# EAGLE design gases2 (EAGLE 9.6.2)
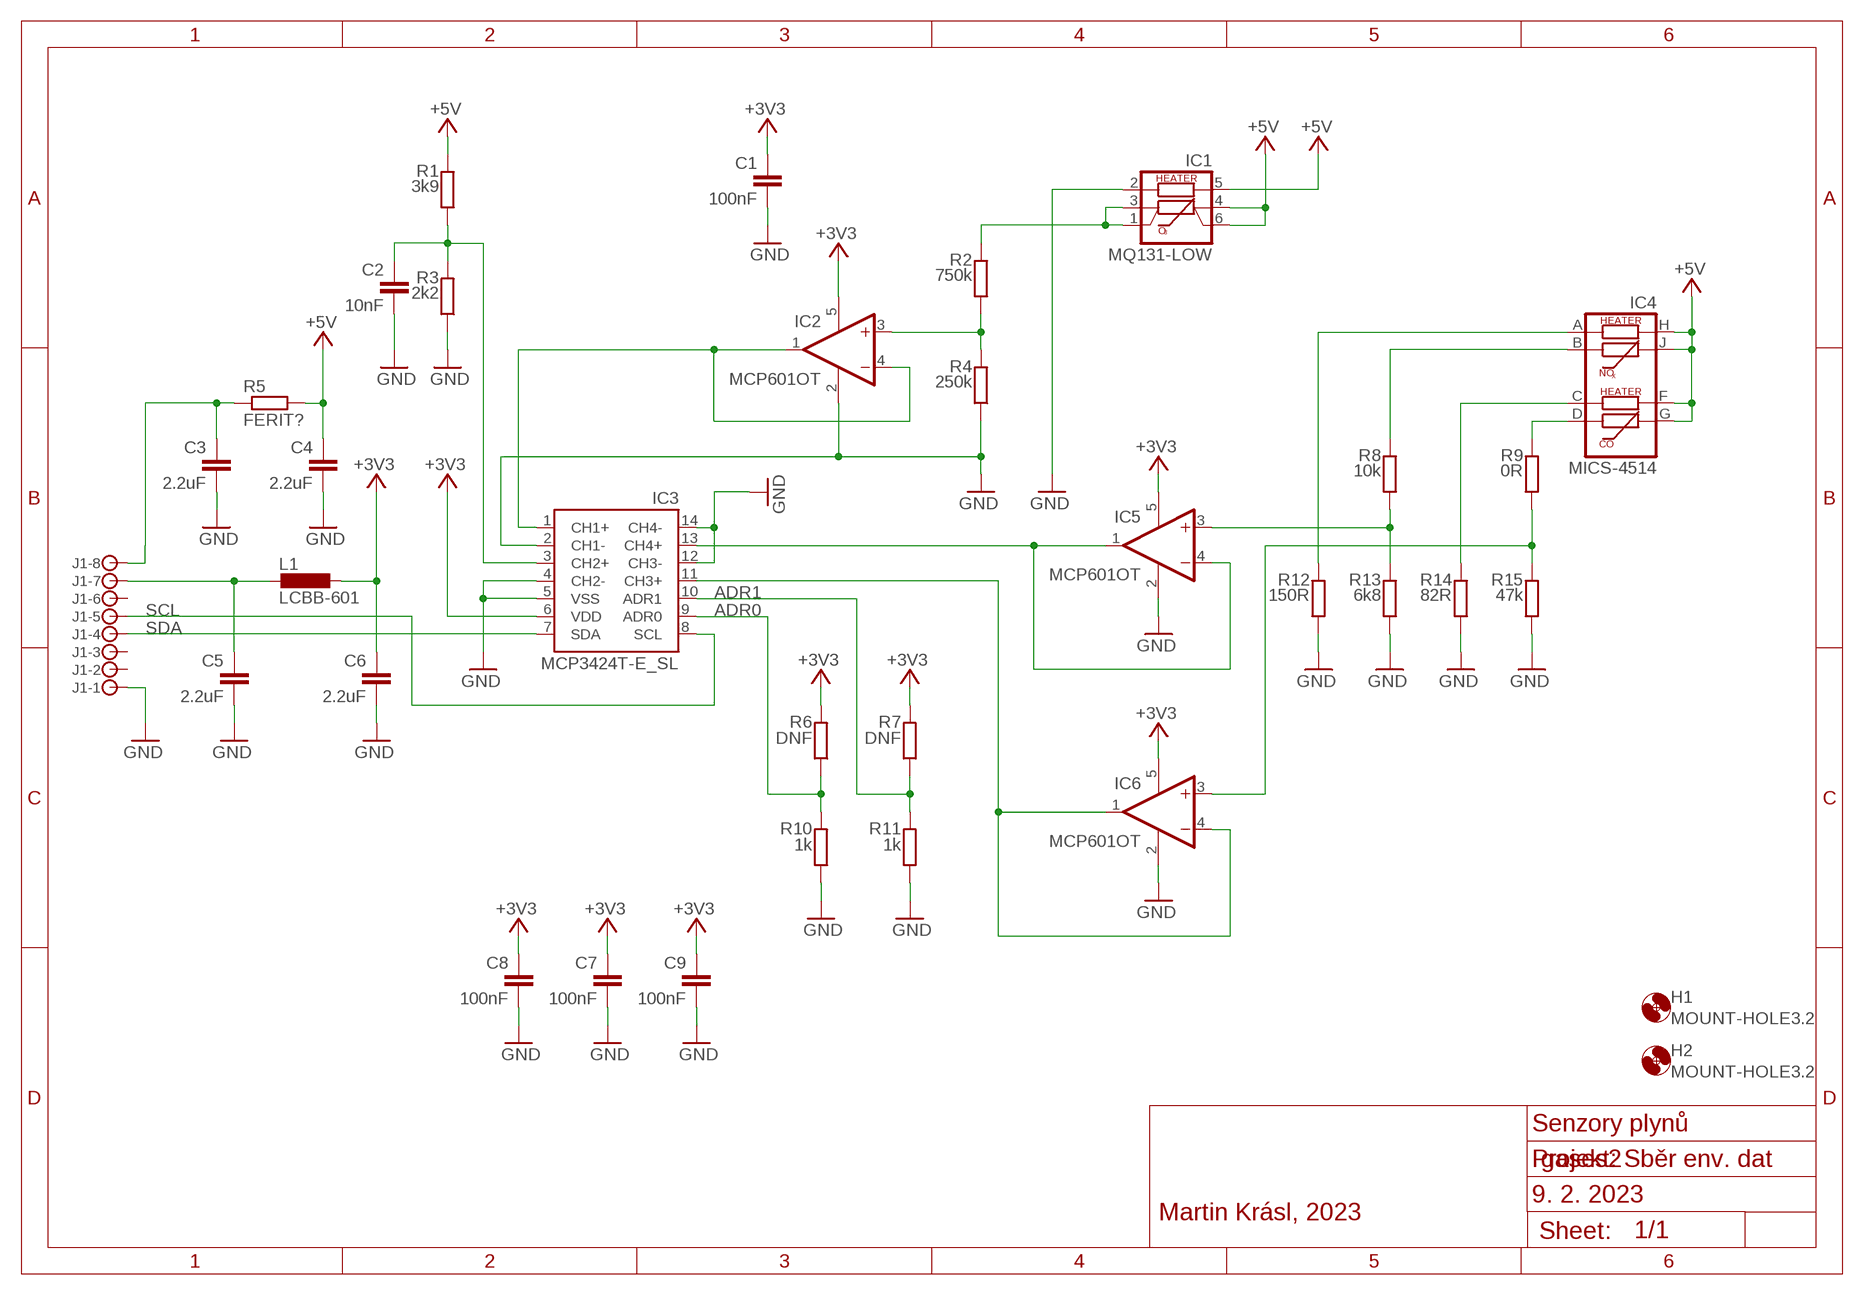
[diagram p0: schematic, sheet 1]

## Parts
C1  100nF  C-EUC0402  [C0402]
C2  10nF  C-EUC0402  [C0402]
C3  2.2uF  C-EUC0402  [C0402]
C4  2.2uF  C-EUC0402  [C0402]
C5  2.2uF  C-EUC0402  [C0402]
C6  2.2uF  C-EUC0402  [C0402]
C7  100nF  C-EUC0402  [C0402]
C8  100nF  C-EUC0402  [C0402]
C9  100nF  C-EUC0402  [C0402]
H1  MOUNT-HOLE3.2  [3,2]
H2  MOUNT-HOLE3.2  [3,2]
IC1  MQ131-LOW  [MQ131-LOW]
IC2  MCP601OT  [SOT23-5]
IC3  MCP3424T-E_SL  [SOIC127P600X175-14N]
IC4  MICS-4514  [MICS-4514]
IC5  MCP601OT  [SOT23-5]
IC6  MCP601OT  [SOT23-5]
J1  JST-XH-8  [B8B-XH-A]
L1  LCBB-601  L-EU2012(0805)  [L2012C]
R1  3k9  R-EU_R0402  [R0402]
R2  750k  R-EU_R0402  [R0402]
R3  2k2  R-EU_R0402  [R0402]
R4  250k  R-EU_R0402  [R0402]
R5  FERIT?  R-EU_R0805  [R0805]
R6  DNF  R-EU_R0402  [R0402]
R7  DNF  R-EU_R0402  [R0402]
R8  10k  R-EU_R0402  [R0402]
R9  0R  R-EU_R0402  [R0402]
R10  1k  R-EU_R0402  [R0402]
R11  1k  R-EU_R0402  [R0402]
R12  150R  R-EU_R1206  [R1206]
R13  6k8  R-EU_R0402  [R0402]
R14  82R  R-EU_R1206  [R1206]
R15  47k  R-EU_R0402  [R0402]

## Nets
+3V3: C1.1 C6.1 C7.1 C8.1 C9.1 IC2.5(V+) IC3.6(VDD) IC5.5(V+) IC6.5(V+) L1.1 R6.2 R7.2
+5V: C4.1 IC1.4 IC1.5 IC1.6 IC4.F IC4.G IC4.H IC4.J R1.2 R5.2
ADR0: IC3.9(ADR0) R6.1 R10.2
ADR1: IC3.10(ADR1) R7.1 R11.2
GND: C1.2 C2.2 C3.2 C4.2 C5.2 C6.2 C7.2 C8.2 C9.2 IC1.2 IC2.2(V-) IC3.2(CH1-) IC3.4(CH2-) IC3.5(VSS) IC3.12(CH3-) IC3.14(CH4-) IC5.2(V-) IC6.2(V-) J1.1 R3.1 R4.1 R10.1 R11.1 R12.1 R13.1 R14.1 R15.1
N$1: IC2.1(OUT) IC2.4(-IN) IC3.1(CH1+)
N$2: C2.1 IC3.3(CH2+) R1.1 R3.2
N$3: C3.1 J1.8 R5.1
N$4: IC2.3(+IN) R2.1 R4.2
N$5: IC1.1 IC1.3 R2.2
N$6: IC4.B R8.2
N$7: IC4.D R9.2
N$8: IC5.3(+IN) R8.1 R13.2
N$9: IC4.A R12.2
N$10: IC4.C R14.2
N$11: C5.1 J1.7 L1.2
N$12: IC6.3(+IN) R9.1 R15.2
N$13: IC3.13(CH4+) IC5.1(OUT) IC5.4(-IN)
N$14: IC3.11(CH3+) IC6.1(OUT) IC6.4(-IN)
SCL: IC3.8(SCL) J1.5
SDA: IC3.7(SDA) J1.4
Unconnected: J1.2 J1.3 J1.6

## Notes on the sheet
- Senzory plynů
- Projekt: Sběr env. dat
- 9. 2. 2023
- Martin Krásl, 2023

## Library data of the parts
C1-C9 = rcl:C-EU: CAPACITOR, European symbol; SPICEPREFIX: C
H1 H2 = holes:MOUNT-HOLE: MOUNTING HOLE with drill center marker
IC1 = MKLIB:MQ131-LOW
IC2 IC5 IC6 = linear:MCP601: Single Op Amp 2.7V to 6.0V Single Supply CMOS Source: http://ww1.microchip.com/downloads/en/DeviceDoc/21314g.pdf
IC3 = MCP3424T-E_SL:MCP3424T-E_SL: Analog to Digital Converters - ADC 18B delta-sigma ADC dual Ch 4sps Source: Datasheet <https://datasheet.datasheetarchive.com/originals/dk/DKDS-14/279441.pdf>; ARROW_PART_NUMBER: MCP3424T-E/SL; ARROW_PRICE-STOCK: https://www.arrow.com/en/products/mcp3424t-esl/microchip-technology?region=nac; DESCRIPTION: Analog to Digital Converters - ADC 18B delta-sigma ADC dual Ch 4sps; HEIGHT: 1.75mm; MANUFACTURER_NAME: Microchip; MANUFACTURER_PART_NUMBER: MCP3424T-E/SL; MOUSER_PART_NUMBER: 579-MCP3424T-E/SL; MOUSER_PRICE-STOCK: https://www.mouser.co.uk/ProductDetail/Microchip-Technology-Atmel/MCP3424T-E-SL?qs=87%2Fgv35YuOcOtmXR930Twg%3D%3D
IC4 = MKLIB:MICS-4514
J1 = con-JST-XH:JST-XH-8: JST-XH 4-way vertical TH; MF: JST; MPN: B8B-XH-A
L1 = MKLIB:L-EU
R1-R15 = rcl:R-EU_: RESISTOR, European symbol; SPICEPREFIX: R

## Net classes
0 default: width 0.152 mm, clearance 0.152 mm

## Board
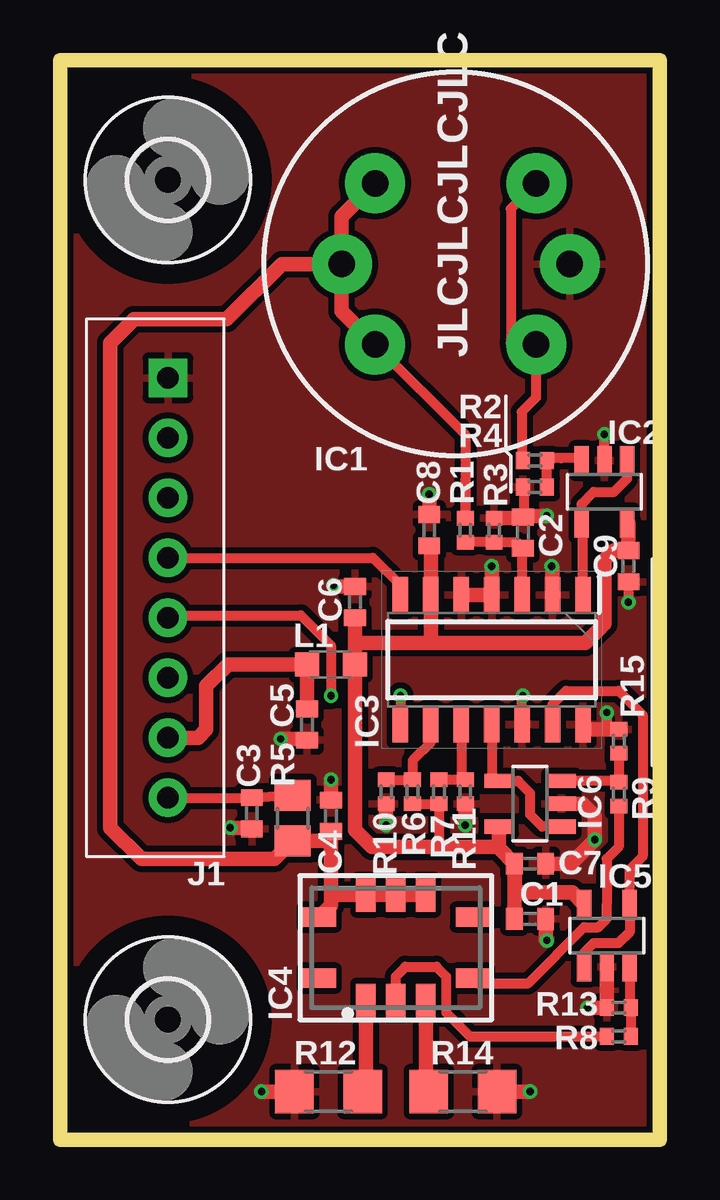
[diagram p1: board, top side]
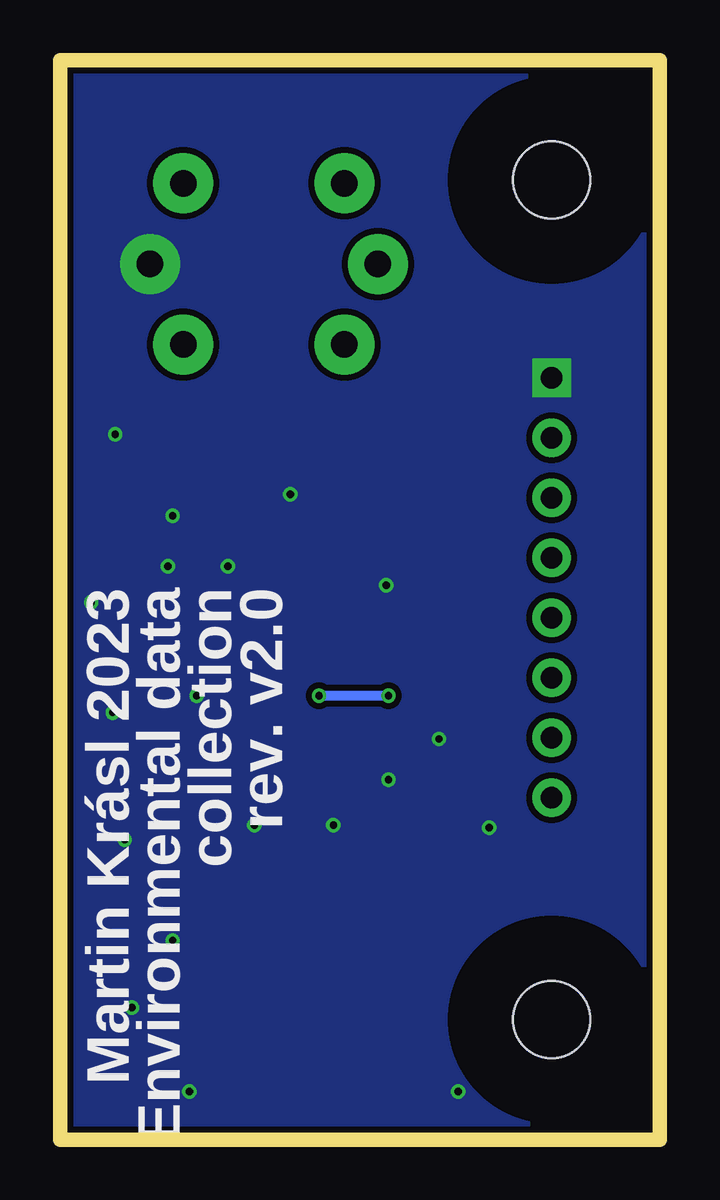
[diagram p2: board, bottom side, seen from below]

Size 25 x 45 mm. Coordinates in mm from the lower left corner, seen from the top.
Outline: 0,0 0,45 25,45 25,0 0,0
Copper layers (1*16): Top 0.035mm / dielectric 1.6mm / Bottom 0.035mm
Design rules "jlcpcb-2layers *": minimum track width 16mil, minimum drill 0.3mm, track to track 5mil, track to pad 5mil, pad to pad 5mil, via to via 5mil, smd to smd 5mil, copper to edge 0.2mm, drill to drill 6mil, minimum pad ring 10mil, minimum via ring 3mil, stop-mask expansion 4mil, vias tented up to drill 0.3mm, thermal gap 10mil

### Footprints (pad centres in the part's own frame; a part is rotated, then mirrored left to right if it is on the bottom)
C0402 = smd 0.7 x 0.9: 1 -0.65,0; 2 0.65,0
3,2 = hole 3.2: 0,0
MQ131-LOW = drill 1.1 pad 2.5: 1 -3.359,3.359; 2 -4.75,0; 3 -3.359,-3.359; 4 3.359,-3.359; 5 4.75,0; 6 3.359,3.359
SOT23-5 = smd 0.6 x 1.2: 1 -0.95,-1.306; 2 0,-1.306; 3 0.95,-1.306; 4 0.95,1.306; 5 -0.95,1.306
SOIC127P600X175-14N = smd 1.5 x 0.65: 1 -2.7,3.81; 2 -2.7,2.54; 3 -2.7,1.27; 4 -2.7,0; 5 -2.7,-1.27; 6 -2.7,-2.54; 7 -2.7,-3.81; 8 2.7,-3.81; 9 2.7,-2.54; 10 2.7,-1.27; 11 2.7,0; 12 2.7,1.27; 13 2.7,2.54; 14 2.7,3.81
MICS-4514 = smd 0.8 x 1.4: A -1.25,-2.2; B 0,-2.2; C 1.25,-2.2; F 1.25,2.2; G 0,2.2; H -1.25,2.2 | smd 1.4 x 0.8: D 3.2,-1.27; E 3.2,1.27; J -3.2,1.27; K -3.2,-1.27
B8B-XH-A = drill 0.9 square: 1 8.75,0 | drill 0.9: 2 6.25,0; 3 3.75,0; 4 1.25,0; 5 -1.25,0; 6 -3.75,0; 7 -6.25,0; 8 -8.75,0
L2012C = smd 1 x 1: 1 -1,0; 2 1,0
R0402 = smd 0.6 x 0.7: 1 -0.5,0; 2 0.5,0
R0805 = smd 1.3 x 1.5: 1 -0.95,0; 2 0.95,0
R1206 = smd 1.6 x 1.803: 1 -1.422,0; 2 1.422,0

### Placement (x,y rotation side)
C1  19.6,9.2 0 top
C2  19.3,25.3 90 top
C3  8,13.6 270 top
C4  11.3,13.5 90 top
C5  10.3,17.3 270 top
C6  12.3,22.4 90 top
C7  19.6,11.5 0 top
C8  15.4,25.4 90 top
C9  23.7,23.9 270 top
H1  4.5,40 0 top
H2  4.5,5 0 top
IC1  16.5,36.5 180 top
IC2  22.7,27 180 top
IC3  18,20 270 top
IC4  14,8 0 top
IC5  22.8,8.5 0 top
IC6  19.6,14 90 top
J1  4.5,23 90 top
L1  11.3,19.8 180 top
R1  16.9,25.4 90 top
R2  19.8,28.3 180 top
R3  18.1,25.4 270 top
R4  19.8,27.2 0 top
R5  9.7,13.4 270 top
R6  14.7,14.5 270 top
R7  15.8,14.5 270 top
R8  23.3,4.3 180 top
R9  23.3,14.4 270 top
R10  13.6,14.5 90 top
R11  16.9,14.5 90 top
R12  11.2,2 0 top
R13  23.3,5.5 0 top
R14  16.8,2 180 top
R15  23.3,16.6 270 top

### Tracks (layer width: path | path; a pad name or v marks a point on that pad's centre or on a via)
+3V3
  Top 0.406: 23.7,25.7 IC2.5 23.65,24.55 C9.1 | 15.46,24.69 C8.1 15.35,24.7 | C7.1 18.29,12.16 18.29,12.2 18.29,12.4 IC6.5 | R6.2 R7.2 15.8,12.3 15.7,12.2 | 23.1,24.55 22.7,24.15 22.7,23.8 | 22.55,21.35 22.7,21.5 | C6.1 L1.1 | 18.95,10.7 18.85,10.8 18.85,11.4 C7.1 | C7.1 19.05,11.4 19.05,10.3
  Top 0.61: 15.46,24.69 IC3.6 15.46,20.74 15.5,20.7 17.1,20.7 | IC6.5 18.29,12.16 | 18.95,11.4 C7.1 18.29,12.16 | 22.55,21.35 21.9,20.7 17.1,20.7 | 22.7,21.5 22.7,23.8 22.7,24.15 23.1,24.55 C9.1 23.7,25.7 | 12.3,20.7 L1.1 12.3,12.9 13,12.2 15.7,12.2 18.29,12.2 18.29,12.16 | 17.1,20.7 13.2,20.7 12.3,20.7 | IC5.5 21.36,10.3 19.05,10.3 | 18.95,10.7 C1.1 | C6.1 12.3,20.7
+5V
  Top 0.406: 13.16,33.14 IC1.6 16.9,29.38 16.9,26.1 | IC1.5 | IC4.H 12.75,10.45 12.7,10.5 | 11.3,10.2 11.3,9.77 | 9.65,12.4 R5.2 | R1.2 16.9,26.1 | 16.9,26.1 16.9,27.5
  Top 0.61: IC1.6 11.74,34.54 IC1.5 11.74,38.46 IC1.4 | 11.3,10.2 IC4.H 14.3,10.2 | IC4.F 14.3,10.2 | IC4.G 14.3,10.2 | 9.65,12.4 8.95,11.7 3.4,11.7 2.1,13 2.1,26.7 | 2.1,27.2 2.1,26.7 | R5.2 10.9,12.45 | 10.9,12.45 11.3,12.45 11.3,9.77 IC4.J | 10.9,12.45 C4.1 | 2.1,26.7 2.1,33.2 3.1,34.2 6.95,34.2 9.25,36.5 IC1.5
ADR0
  Top 0.406: R10.2 R6.1 14.7,15.8 15.46,16.56 IC3.9
ADR1
  Top 0.406: R11.2 16.8,15 | 16.8,15 R7.1 | IC3.10 16.73,15.07 16.8,15
GND  (via drill 0.3 pad 0.6)
  Top 0.406: 22.8,6.4 22.8,6.8 | C3.2 8,13 | 13.45,13.85 R10.1 | IC3.14 22.01,17.1 22.8,17.1 v22.8,17.8 | C2.2 19.25,25.9 | 20.54,23.86 v20.5,23.9 | IC2.2 v22.7,29.4 | C9.2 v23.7,22.4 | IC3.12 19.27,18.47 v19.3,18.5 | R4.1 19.35,27.15 19.35,26
  Top 0.61: 8,13 v7.1,13 | R10.1 v13.6,13.1 | R11.1 v16.9,13.1 | 22.01,17.1 R15.1 | 19.25,25.9 R3.1 | C8.2 15.4,26.65 v15.4,26.9 | IC3.2 20.54,23.86 | v20.3,26 19.35,26 C2.2 | IC3.5 17.4,22.7 IC3.4 v18,23.9 | v11.3,15 C4.2 | R12.1 v8.4,2 | v19.6,2 R14.1 | IC6.2 21.8,14 22.3,13.5 v22.3,12.5 21.3,11.5 C7.2 | C1.2 20.25,8.35 v20.3,8.3 | v22,5.5 R13.1 22.8,6.6 IC5.2 22.8,6.4 | C6.2 11.45,23.05 v11.4,23.1 | v9.2,16.7 10.4,16.7 10.35,16.65 C5.2
  pour Bottom (isolate 0.25, no thermals): 0,45 24.8,45 25,44.8 25,0.1 24.8,-0.1 0.2,-0.1 0.1,0 0,0.1
  pour Top (isolate 0.25): -1.4,45.6 26.1,45.6 26.1,-0.7 -1.4,-0.7
  pour Bottom (isolate 0.25): -1.8,46.1 26.7,46.1 26.7,-1.4 -1.8,-1.4
N$1
  Top 0.406: IC3.1 21.81,25.63 IC2.4 21.75,26.5 22.24,26.99 23.1,26.99 23.65,27.54 IC2.1
N$2
  Top 0.406: R1.1 R3.2 19.05,24.9 C2.1 19.27,24.62 IC3.3
N$3
  Top 0.406: J1.8 7.9,14.25 C3.1 9.2,14.35 R5.1
N$4
  Top 0.406: 20.9,28.41 21.65,28.41 IC2.3 21.75,28.11 | 20.9,28.41 20.4,28.41 20.45,28.35 20.4,28.3 R2.1 R4.2 | 20.9,28.41 20.59,28.41
N$5
  Top 0.406: IC1.3 18.8,38.8 18.8,33.2 18.86,33.14 IC1.1 19.86,30.94 19.26,30.34 19.26,28.34 R2.2
N$6
  Top 0.406: IC4.B 14,6.8 14.4,7.2 15.7,7.2 16.1,6.8 16.1,5.3 17.1,4.3 R8.2
N$7
  Top 0.406: R9.2 23.3,12.2 22.8,11.7 22.8,9.8 22.8,9.2 22.45,8.85 21.85,8.85 19.5,6.5 17.43,6.5 IC4.D
N$8
  Top 0.406: IC5.3 23.75,5.55 R13.2 R8.1
N$9
  Top 0.406: R12.2 12.61,2.02 12.48,2.08 12.75,2.35
  Top 0.61: IC4.A 12.75,2.35
N$10
  Top 0.406: R14.2 15.25,2
  Top 0.61: 15.25,2 IC4.C
N$11
  Top 0.61: J1.7 5.75,16.75 6.1,17.1 6.1,18.9 7,19.8 L1.2 C5.1
N$12
  Top 0.406: R15.2 R9.1 23.35,14.95 IC6.3 20.96,14.9
N$13
  Top 0.406: IC3.13 20.54,18.14 21.1,18.7 23.3,18.7 24.29,17.71 24.29,11.8 23.75,11.26 IC5.4 23.75,8.65 23.29,8.19 22.25,8.19 21.85,7.79 IC5.1
N$14
  Top 0.406: IC3.11 18,14.9 18.24,14.9 IC6.4 19.09,14.95 19.6,14.44 19.6,13.55 20.1,13.05 IC6.1
SCL  (via drill 0.3 pad 0.6)
  Top 0.406: J1.5 4.6,21.85 10.05,21.85 11.3,20.6 v11.3,18.5 | v14.2,18.5 IC3.8
  Bottom 0.406: v11.3,18.5 v14.2,18.5
SDA
  Top 0.406: J1.4 13.05,24.25 14.19,23.11 IC3.7

### Text on the board
tPlace: JLCJLCJLCJLC
bPlace: Martin Krásl 2023 / Environmental data / collection / rev. v2.0